# EasyEDA schematic SCH_d_01_e_04.json
TITLE: Sheet_1; REV: 1.0; Date: 2025-01-14; Sheet: 1/1; Drawn By: artem.v.ulyanov; Company: Your Company
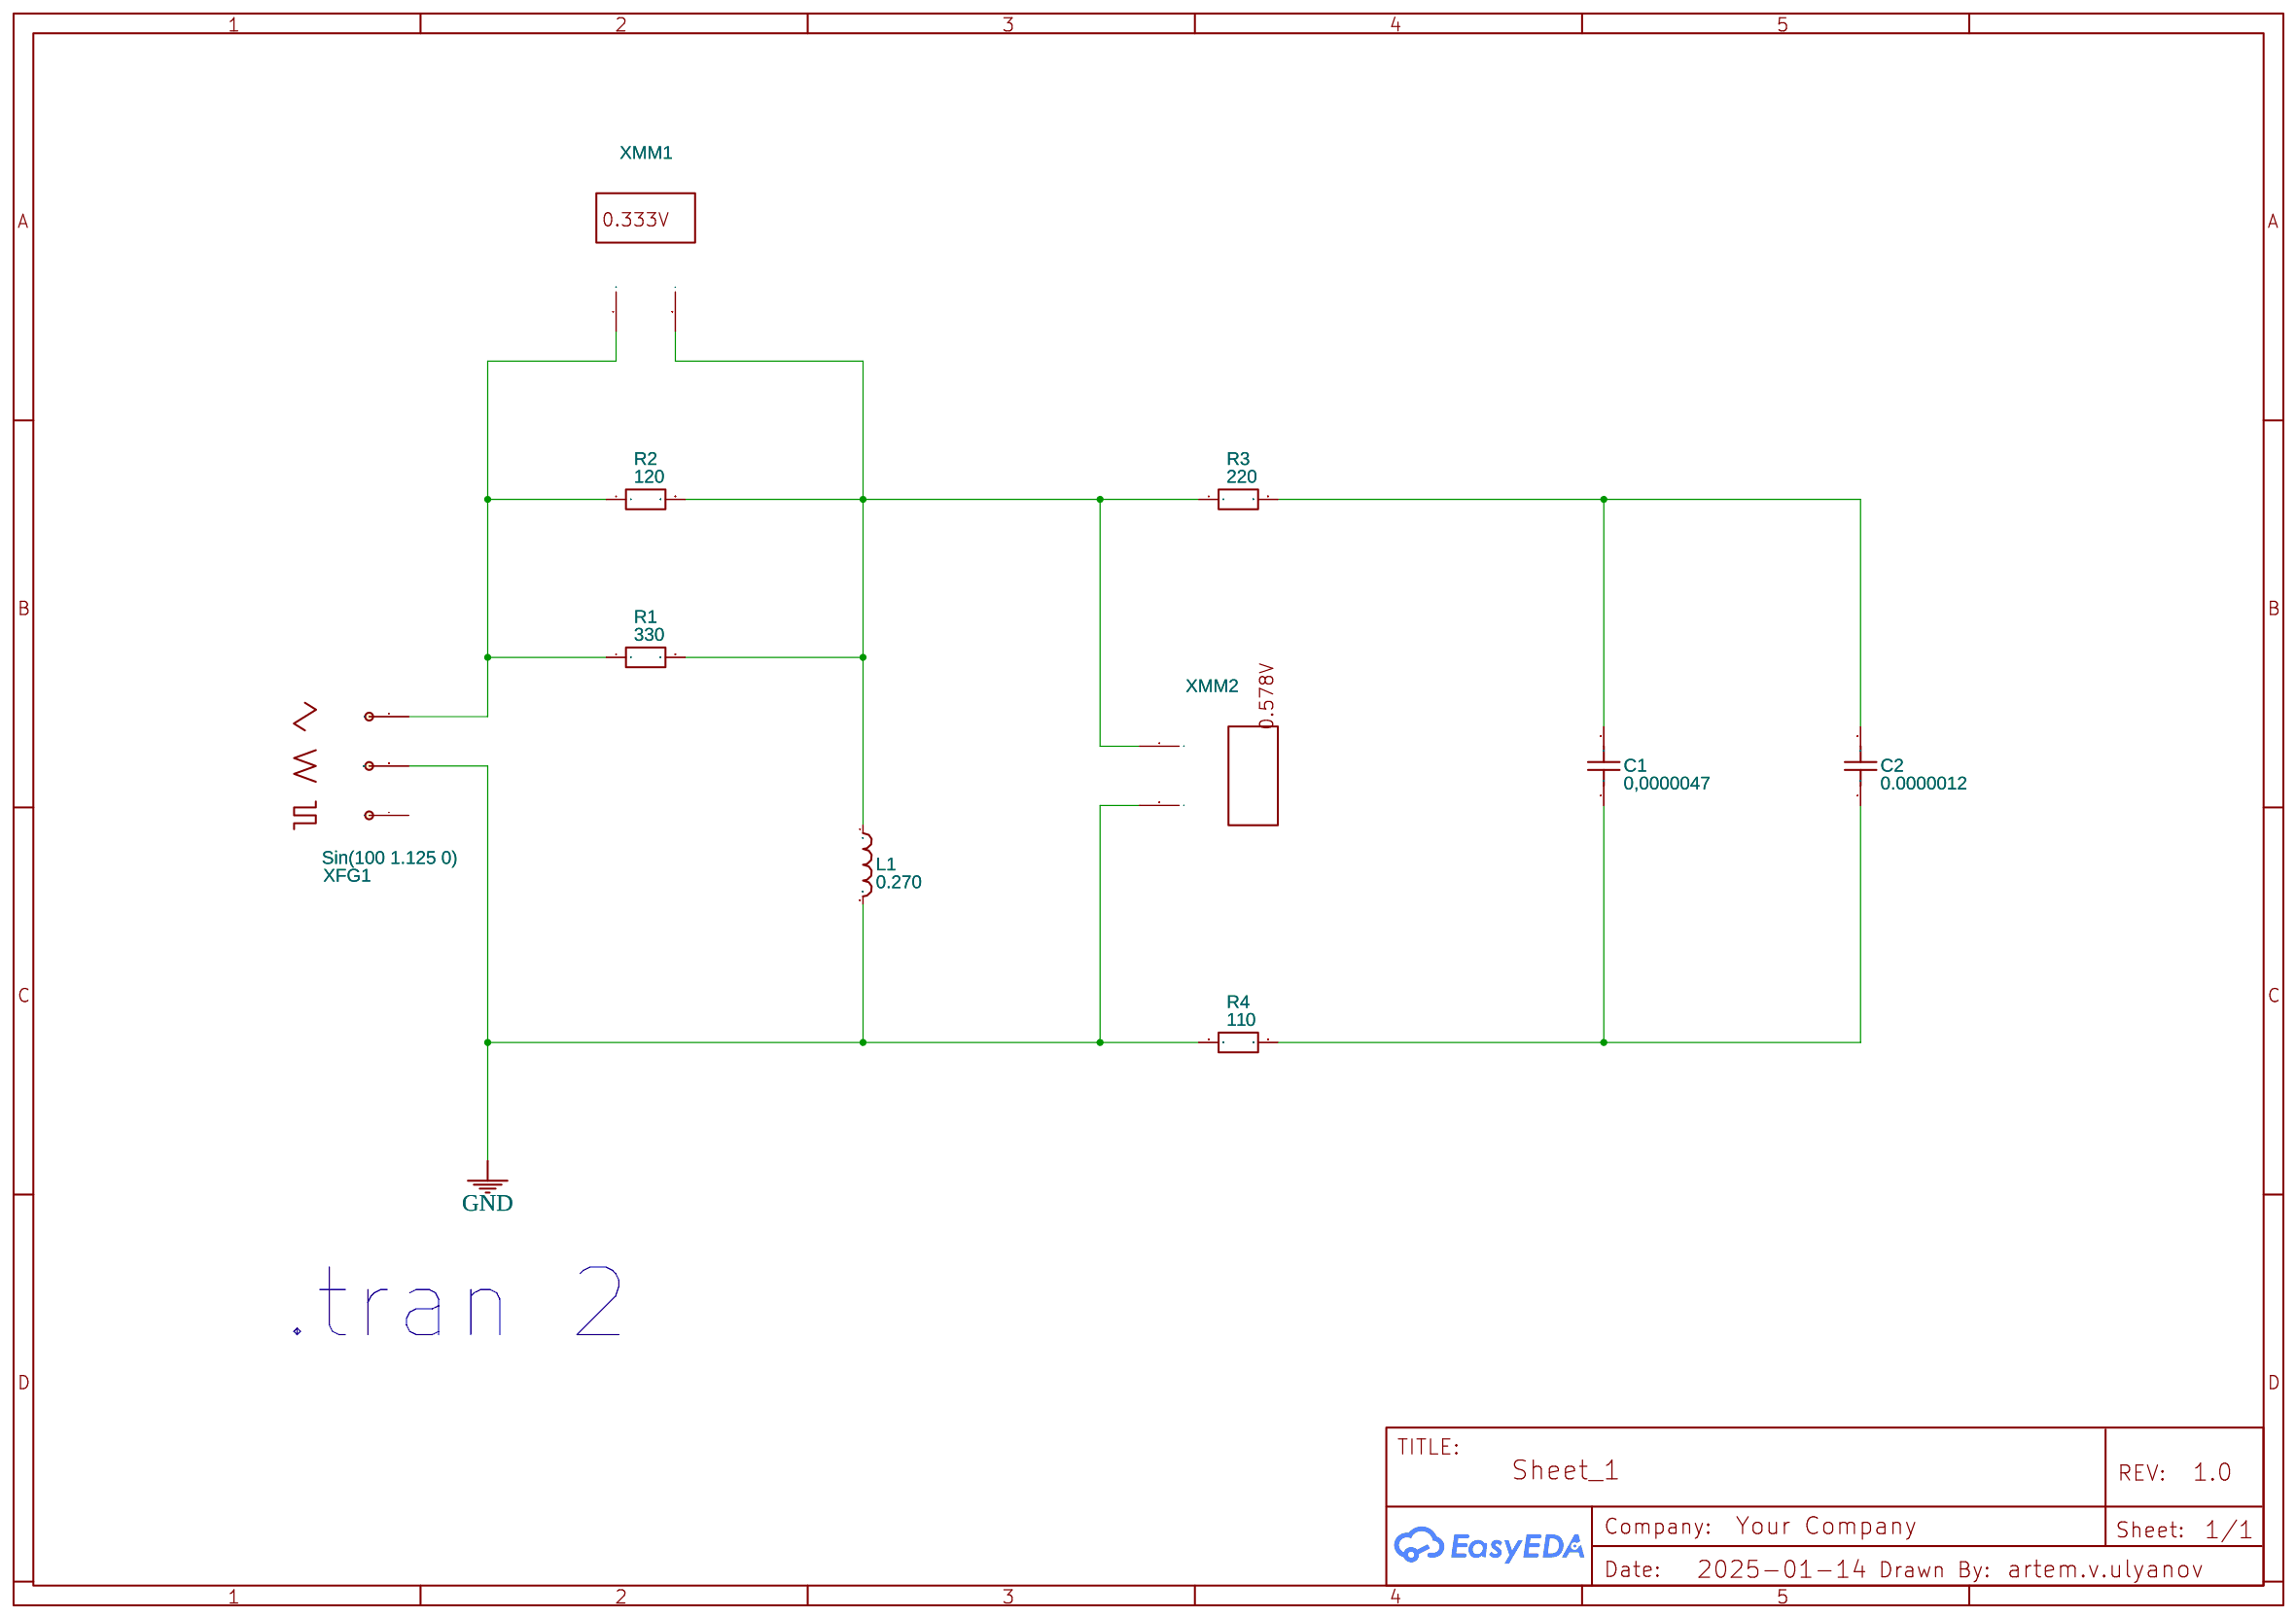
[diagram p0: schematic sheet]

## Parts
C1  0,0000047  [RAD-0.1]
C2  0.0000012  [RAD-0.1]
L1  0.270  [AXIAL-0.4]
R1  330  [R0603]
R2  120  [R0603]
R3  220  [R0603]
R4  110  [R0603]
XFG1  Sin(100 1.125 0)
XMM1  Multimeter
XMM2  Multimeter

## Library data of the parts
C1 C2 = Capacitor_US: Contributor: EasyEDA; Supplier: YUJING; Capacitance: 1u
L1 = Inductor: Supplier: YUJING; Contributor: EasyEDA; Inductance: 1m
R1-R4 = R_0603_EU: Contributor: LCEDA_Lib
XFG1 = FUNCTIONGENERATOR: Supplier: LCSC; Waveforms: Sine Wave; Frequency: 100; Duty cycle: 50; Amplitude: 1.125; Offset: 0; Rise/Fall Time: 10; NameDisplay: 1; Contributor: EasyEDA; sim: true
XMM1 XMM2 = MULTIMETER: Supplier: LCSC; Multimeter Type: Voltmeter; Power Type: AC; Voltmeter resistance: 10μ; Ammeter resistance: 1G; NameDisplay: 0; Contributor: EasyEDA; sim: true

## Nets
GND: L1.2 R4.1 XFG1.COM XMM2.2(I)
Net-(C1-1): C1.1 C2.1 R4.2
Net-(C1-2): C1.2 C2.2 R3.2
Net-(L1-1): L1.1 R1.2 R2.2 R3.1 XMM1.2(I) XMM2.1(+)
Net-(R1-1): R1.1 R2.1 XFG1.+ XMM1.1(+)

Not connected (* = marked no-connect by the designer): XFG1 -

## Notes on the sheet
- .tran 2
